# Altium schematic sheet USB_TTL.SchDoc
size A4; SheetNumber: 4; SheetTotal: 4
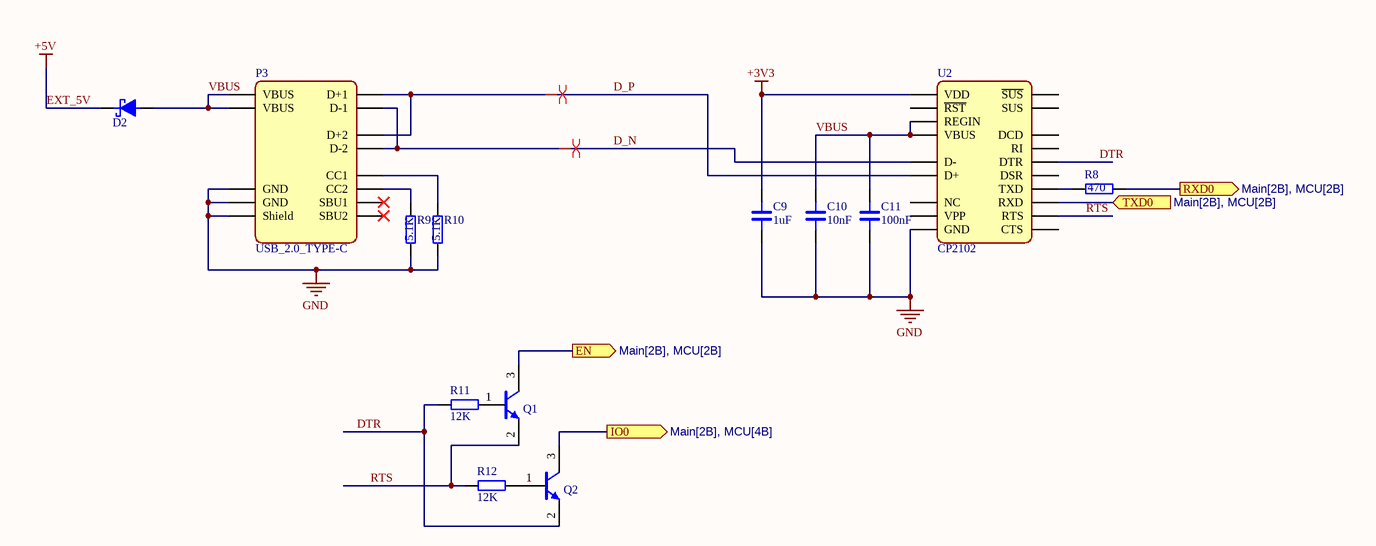
[diagram p0: USB_TTL.SchDoc]

## Parts
C9  1uF  [CAP_0603]
C10  10nF  [CAP_0603]
C11  100nF  [CAP_0603]
D2  SS34  [DIO_SMA]  (value not drawn)
P3  USB_2.0_TYPE-C  [CON_USB_2.0_TYPE-C]
Q1  BC846x  [BJT_ BC846x]  (value not drawn)
Q2  BC846x  [BJT_ BC846x]  (value not drawn)
R8  470  [RES_0603]
R9  5.1K  [RES_0603]
R10  5.1K  [RES_0603]
R11  12K  [RES_0603]
R12  12K  [RES_0603]
U2  CP2102  [INF_CP2102]

## Ports
EN (out, see Main[2B], MCU[2B]), IO0 (out, see Main[2B], MCU[4B]), RXD0 (out, see Main[2B], MCU[2B]), TXD0 (in, see Main[2B], MCU[2B])

## Nets
+3V3: C9.2 U2.6(VDD)
EXT_5V: D2.C  [also labelled +5V]
GND: C9.1 C10.1 C11.1 P3.A1/B12(GND) P3.A12/B1(GND) P3.Shell(Shield) R9.1 R10.1 U2.3(GND)
D_N: P3.A7(D-1) P3.B7(D-2) U2.5(D-)
D_P: P3.A6(D+1) P3.B6(D+2) U2.4(D+)
DTR: Q2.2(E) R11.1 U2.28(DTR)
EN: Q1.3(C) ; port EN
IO0: Q2.3(C) ; port IO0
RTS: Q1.2(E) R12.1 U2.24(RTS)
RXD0: R8.2 ; port RXD0
TXD0: U2.25(RXD) ; port TXD0
VBUS: C10.2 C11.2 D2.A P3.A4/B9(VBUS) P3.A9/B4(VBUS) U2.7(REGIN) U2.8(VBUS)
NetP3_A5: P3.A5(CC1) R10.2
NetP3_B5: P3.B5(CC2) R9.2
NetQ1_1: Q1.1(B) R11.2
NetQ2_1: Q2.1(B) R12.2
NetR8_1: R8.1 U2.26(TXD)

Not connected (* = marked no-connect by the designer): P3 A8(SBU1)* B8(SBU2)*; U2 1(DCD) 2(RI) 9(~{RST}) 10,13,14,15,16,17,19,20,21,22(NC) 11(~{SUS}) 12(SUS) 18(VPP) 23(CTS) 27(DSR)

## Layout directives
differential pair: D_N, D_P

## Library data of the parts
C9-C11 = CAP_0603: 0603 Multilayer Ceramic Capacitors MLCC - SMD/SMT ROHS; LCSC Part: ?; JLCPCB Part: ?; Mfr. Part: ?; Voltage: ?
  C9: Value: 1uF
  C10: Value: 10nF
  C11: Value: 100nF
D2 = DIO_SS34: 40V 500mV@3A 3A SMC (SBD); Mfr. Part: ?; JLCPCB Part: ?; LCSC Part: ?
P3 = CON_USB_2.0_TYPE-C: USB Connectors USB Jack 2.0, Type-C, Horizontal SMT; Mrf. Part: ?; LCSC Part: ?; JLCPCB Part: ?
Q1 Q2 = BJT_ BC846x: Single Bipolar Transistor, NPN, 65 V, 100 mA, 250 mW, SOT23 (TO-236AB), 3 Pins, Surface Mount; Mrf. Part: ?; LCSC Part: ?; JLCPCB Part: ?
R8-R12 = RES_0603: 0603 Thick Film Resistor - Surface Mount ROHS; Mfr. Part: ?; LCSC Part: ?; JLCPCB Part: ?
  R8: Value: 470
  R9 R10: Value: 5.1K
  R11 R12: Value: 12K
U2 = INF_CP2102: USB to UART bridge USB 2.0 3.3V, CP2102-GMR, VFQFN-28; Mrf. Part: ?; LCSC Part: *; JLCPCB Part: ?